# Altium schematic sheet 16 SATA3 CONTROLLER.SchDoc
size 420 x 297 mm
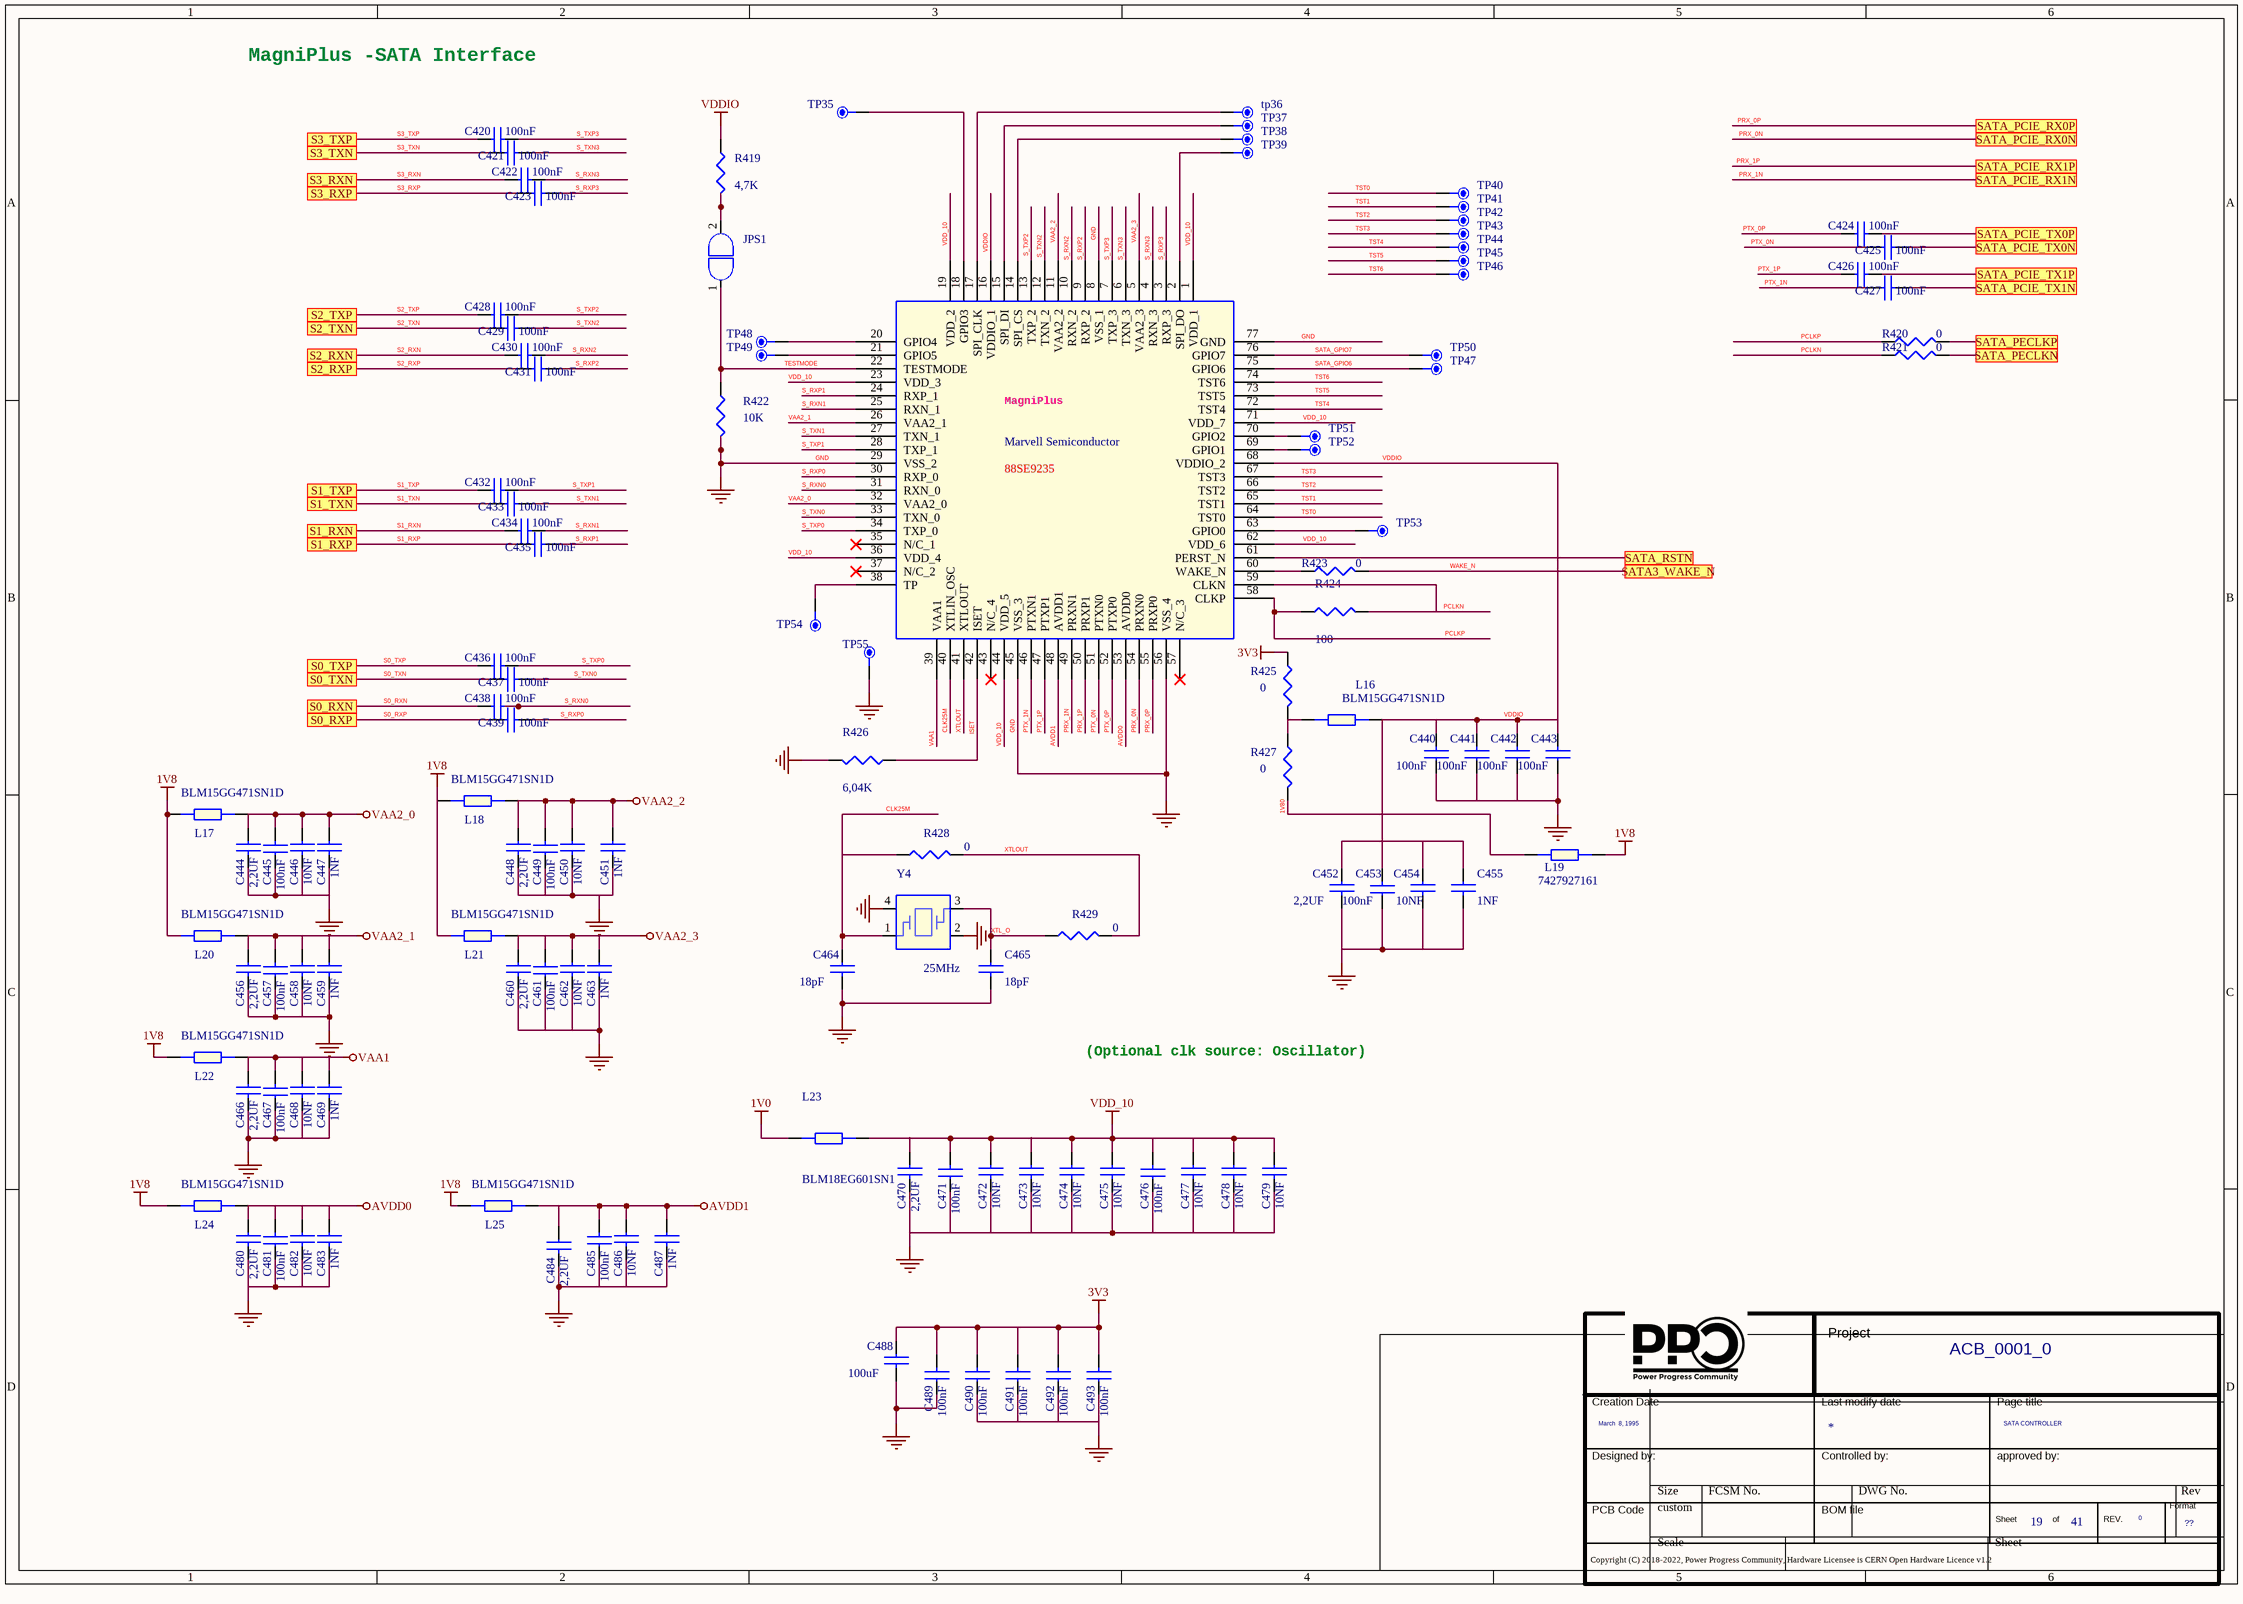
[diagram p0: 16 SATA3 CONTROLLER.SchDoc]

## Parts
*  Page Count: 41  Page Create Date: March  8, 1995  Page Number: 19  Page Size: ??  Page Title: SATA CONTROLLER  RevCode: 0  Title: ACB_0001_0  (hidden comment: Title_block_PPC)  (graphical)
C420  100nF  [SMD_0402]
C421  100nF  [SMD_0402]
C422  100nF  [SMD_0402]
C423  100nF  [SMD_0402]
C424  100nF  [SMD_0402]
C425  100nF  [SMD_0402]
C426  100nF  [SMD_0402]
C427  100nF  [SMD_0402]
C428  100nF  [SMD_0402]
C429  100nF  [SMD_0402]
C430  100nF  [SMD_0402]
C431  100nF  [SMD_0402]
C432  100nF  [SMD_0402]
C433  100nF  [SMD_0402]
C434  100nF  [SMD_0402]
C435  100nF  [SMD_0402]
C436  100nF  [SMD_0402]
C437  100nF  [SMD_0402]
C438  100nF  [SMD_0402]
C439  100nF  [SMD_0402]
C440  100nF  [SMD_0402]
C441  100nF  [SMD_0402]
C442  100nF  [SMD_0402]
C443  100nF  [SMD_0402]
C444  2,2UF  [SMD_0402]
C445  100nF  [SMD_0402]
C446  10NF  [SMD_0402]
C447  1NF  [SMD_0402]
C448  2,2UF  [SMD_0402]
C449  100nF  [SMD_0402]
C450  10NF  [SMD_0402]
C451  1NF  [SMD_0402]
C452  2,2UF  [SMD_0402]
C453  100nF  [SMD_0402]
C454  10NF  [SMD_0402]
C455  1NF  [SMD_0402]
C456  2,2UF  [SMD_0402]
C457  100nF  [SMD_0402]
C458  10NF  [SMD_0402]
C459  1NF  [SMD_0402]
C460  2,2UF  [SMD_0402]
C461  100nF  [SMD_0402]
C462  10NF  [SMD_0402]
C463  1NF  [SMD_0402]
C464  18pF  [SMD_0402]
C465  18pF  [SMD_0402]
C466  2,2UF  [SMD_0402]
C467  100nF  [SMD_0402]
C468  10NF  [SMD_0402]
C469  1NF  [SMD_0402]
C470  2,2UF  [SMD_0402]
C471  100nF  [SMD_0402]
C472  10NF  [SMD_0402]
C473  10NF  [SMD_0402]
C474  10NF  [SMD_0402]
C475  10NF  [SMD_0402]
C476  100nF  [SMD_0402]
C477  10NF  [SMD_0402]
C478  10NF  [SMD_0402]
C479  10NF  [SMD_0402]
C480  2,2UF  [SMD_0402]
C481  100nF  [SMD_0402]
C482  10NF  [SMD_0402]
C483  1NF  [SMD_0402]
C484  2,2UF  [SMD_0402]
C485  100nF  [SMD_0402]
C486  10NF  [SMD_0402]
C487  1NF  [SMD_0402]
C488  100uF  [SMD_0805]
C489  100nF  [SMD_0402]
C490  100nF  [SMD_0402]
C491  100nF  [SMD_0402]
C492  100nF  [SMD_0402]
C493  100nF  [SMD_0402]
JPS1  SOLDER JUMPER X 2  [PCB]  (value not drawn)
L16  BLM15GG471SN1D  [SMD_0402]
L17  BLM15GG471SN1D  [SMD_0402]
L18  BLM15GG471SN1D  [SMD_0402]
L19  7427927161  [SMD_0402]
L20  BLM15GG471SN1D  [SMD_0402]
L21  BLM15GG471SN1D  [SMD_0402]
L22  BLM15GG471SN1D  [SMD_0402]
L23  BLM18EG601SN1  [SMD_0603]
L24  BLM15GG471SN1D  [SMD_0402]
L25  BLM15GG471SN1D  [SMD_0402]
R419  4,7K  [SMD_0402]
R420  0  [SMD_0402]
R421  0  [SMD_0402]
R422  10K  [SMD_0402]
R423  0  [SMD_0402]
R424  100  [SMD_0402]
R425  0  [SMD_0402]
R426  6,04K  [SMD_0603]
R427  0  [SMD_0402]
R428  0  [SMD_0402]
R429  0  [SMD_0402]
TP35  TPS  [TPS]  (value not drawn)
tp36  TPS  [TPS]  (value not drawn)
TP37  TPS  [TPS]  (value not drawn)
TP38  TPS  [TPS]  (value not drawn)
TP39  TPS  [TPS]  (value not drawn)
TP40  TPS  [TPS]  (value not drawn)
TP41  TPS  [TPS]  (value not drawn)
TP42  TPS  [TPS]  (value not drawn)
TP43  TPS  [TPS]  (value not drawn)
TP44  TPS  [TPS]  (value not drawn)
TP45  TPS  [TPS]  (value not drawn)
TP46  TPS  [TPS]  (value not drawn)
TP47  TPS  [TPS]  (value not drawn)
TP48  TPS  [TPS]  (value not drawn)
TP49  TPS  [TPS]  (value not drawn)
TP50  TPS  [TPS]  (value not drawn)
TP51  TPS  [TPS]  (value not drawn)
TP52  TPS  [TPS]  (value not drawn)
TP53  TPS  [TPS]  (value not drawn)
TP54  TPS  [TPS]  (value not drawn)
TP55  TPS  [TPS]  (value not drawn)
U42  Distributor_Part_Number: Marvell Semiconductor  [76-pin QFN 
LBGA-196]  (hidden comment: 88SE9235)
Y4  25MHz  [SMD_5.0x3.2]

## Ports
S0_RXN, S0_RXP, S0_TXN, S0_TXP, S1_RXN, S1_RXP, S1_TXN, S1_TXP, S2_RXN, S2_RXP, S2_TXN, S2_TXP, S3_RXN, S3_RXP, S3_TXN, S3_TXP, SATA3_WAKE_N, SATA_PCIE_RX0N, SATA_PCIE_RX0P, SATA_PCIE_RX1N, SATA_PCIE_RX1P, SATA_PCIE_TX0N, SATA_PCIE_TX0P, SATA_PCIE_TX1N, SATA_PCIE_TX1P, SATA_PECLKN, SATA_PECLKP, SATA_RSTN

## Nets
1V0: L23.1
1V8: L17.1 L18.1 L19.2 L20.1 L21.1 L22.1 L24.1 L25.1
3V3: C488.1 C489.2 C490.2 C491.2 C492.2 C493.2 R425.2
AVDD0: C480.1 C481.2 C482.1 C483.1 L24.2 U42.53(AVDD0)
AVDD1: C484.1 C485.2 C486.1 C487.1 L25.2 U42.48(AVDD1)
GND: C440.1 C441.1 C442.1 C443.1 C444.2 C445.1 C446.2 C447.2 C448.2 C449.1 C450.2 C451.2 C452.2 C453.1 C454.2 C455.2 C456.2 C457.1 C458.2 C459.2 C460.2 C461.1 C462.2 C463.2 C464.2 C465.2 C466.2 C467.1 C468.2 C469.2 C470.2 C471.1 C472.2 C473.2 C474.2 C475.2 C476.1 C477.2 C478.2 C479.2 C480.2 C481.1 C482.2 C483.2 C484.2 C485.1 C486.2 C487.2 C488.2 C489.1 C490.1 C491.1 C492.1 C493.1 R422.2 R426.2 TP55.1 U42.8(VSS_1) U42.29(VSS_2) U42.45(VSS_3) U42.56(VSS_4) U42.77(GND) Y4.2 Y4.4
VAA1: C466.1 C467.2 C468.1 C469.1 L22.2 U42.39(VAA1)
VAA2_0: C444.1 C445.2 C446.1 C447.1 L17.2 U42.32(VAA2_0)
VAA2_1: C456.1 C457.2 C458.1 C459.1 L20.2 U42.26(VAA2_1)
VAA2_2: C448.1 C449.2 C450.1 C451.1 L18.2 U42.11(VAA2_2)
VAA2_3: C460.1 C461.2 C462.1 C463.1 L21.2 U42.5(VAA2_3)
VDD_10: C470.1 C471.2 C472.1 C473.1 C474.1 C475.1 C476.2 C477.1 C478.1 C479.1 L23.2 U42.1(VDD_1) U42.19(VDD_2) U42.23(VDD_3) U42.36(VDD_4) U42.44(VDD_5) U42.62(VDD_6) U42.71(VDD_7)
VDDIO: C440.2 C441.2 C442.2 C443.2 C452.1 C453.2 C454.1 C455.1 L16.1 R419.1 U42.16(VDDIO_1) U42.68(VDDIO_2)
1V80: L19.1 R427.1
CLK25M: C464.1 R428.2 U42.40(XTLIN_OSC) Y4.1
ISET: R426.1 U42.42(ISET)
PCLKN: R421.1 R424.2 U42.59(CLKN)
PCLKP: R420.1 R424.1 U42.58(CLKP)
PRX_0N: U42.54(PRXN0) ; port SATA_PCIE_RX0N
PRX_0P: U42.55(PRXP0) ; port SATA_PCIE_RX0P
PRX_1N: U42.49(PRXN1) ; port SATA_PCIE_RX1N
PRX_1P: U42.50(PRXP1) ; port SATA_PCIE_RX1P
PTX_0N: C425.1 U42.51(PTXN0)
PTX_0P: C424.1 U42.52(PTXP0)
PTX_1N: C427.1 U42.46(PTXN1)
PTX_1P: C426.1 U42.47(PTXP1)
S0_RXN: C438.1 ; port S0_RXN
S0_RXP: C439.1 ; port S0_RXP
S0_TXN: C437.1 ; port S0_TXN
S0_TXP: C436.1 ; port S0_TXP
S1_RXN: C434.1 ; port S1_RXN
S1_RXP: C435.1 ; port S1_RXP
S1_TXN: C433.1 ; port S1_TXN
S1_TXP: C432.1 ; port S1_TXP
S2_RXN: C430.1 ; port S2_RXN
S2_RXP: C431.1 ; port S2_RXP
S2_TXN: C429.1 ; port S2_TXN
S2_TXP: C428.1 ; port S2_TXP
S3_RXN: C422.1 ; port S3_RXN
S3_RXP: C423.1 ; port S3_RXP
S3_TXN: C421.1 ; port S3_TXN
S3_TXP: C420.1 ; port S3_TXP
S_RXN0: C438.2 U42.31(RXN_0)
S_RXN1: C434.2 U42.25(RXN_1)
S_RXN2: C430.2 U42.10(RXN_2)
S_RXN3: C422.2 U42.4(RXN_3)
S_RXP0: C439.2 U42.30(RXP_0)
S_RXP1: C435.2 U42.24(RXP_1)
S_RXP2: C431.2 U42.9(RXP_2)
S_RXP3: C423.2 U42.3(RXP_3)
S_TXN0: C437.2 U42.33(TXN_0)
S_TXN1: C433.2 U42.27(TXN_1)
S_TXN2: C429.2 U42.12(TXN_2)
S_TXN3: C421.2 U42.6(TXN_3)
S_TXP0: C436.2 U42.34(TXP_0)
S_TXP1: C432.2 U42.28(TXP_1)
S_TXP2: C428.2 U42.13(TXP_2)
S_TXP3: C420.2 U42.7(TXP_3)
SATA_GPIO6: TP47.1 U42.75(GPIO6)
SATA_GPIO7: TP50.1 U42.76(GPIO7)
SATA_PCIE_TX0N: C425.2 ; port SATA_PCIE_TX0N
SATA_PCIE_TX0P: C424.2 ; port SATA_PCIE_TX0P
SATA_PCIE_TX1N: C427.2 ; port SATA_PCIE_TX1N
SATA_PCIE_TX1P: C426.2 ; port SATA_PCIE_TX1P
SATA_PECLKN: R421.2 ; port SATA_PECLKN
SATA_PECLKP: R420.2 ; port SATA_PECLKP
SATA_RSTN: U42.61(PERST_N) ; port SATA_RSTN
TESTMODE: JPS1.1 R422.1 U42.22(TESTMODE)
TST0: TP40.1 U42.64(TST0)
TST1: TP41.1 U42.65(TST1)
TST2: TP42.1 U42.66(TST2)
TST3: TP43.1 U42.67(TST3)
TST4: TP44.1 U42.72(TST4)
TST5: TP45.1 U42.73(TST5)
TST6: TP46.1 U42.74(TST6)
WAKE_N: R423.2 ; port SATA3_WAKE_N
XTL_O: C465.1 R429.2 Y4.3
XTLOUT: R428.1 R429.1 U42.41(XTLOUT)
NetJPS1_2: JPS1.2 R419.2
NetL16_2: L16.2 R425.1 R427.2
NetR423_1: R423.1 U42.60(WAKE_N)
NetTP35_1: TP35.1 U42.18(GPIO3)
Nettp36_1: tp36.1 U42.17(SPI_CLK)
NetTP37_1: TP37.1 U42.15(SPI_DI)
NetTP38_1: TP38.1 U42.14(SPI_CS)
NetTP39_1: TP39.1 U42.2(SPI_DO)
NetTP48_1: TP48.1 U42.20(GPIO4)
NetTP49_1: TP49.1 U42.21(GPIO5)
NetTP51_1: TP51.1 U42.70(GPIO2)
NetTP52_1: TP52.1 U42.69(GPIO1)
NetTP53_1: TP53.1 U42.63(GPIO0)
NetTP54_1: TP54.1 U42.38(TP)

Not connected (* = marked no-connect by the designer): U42 35(N/C_1)* 37(N/C_2)* 43(N/C_4)* 57(N/C_3)*

## Notes on the sheet
- MagniPlus -SATA Interface
- (near U42) MagniPlus
- (Optional clk source: Oscillator)
- (in symbol Title_block_PPC) Project; Creation Date; Last modify date; Page title; Designed by:; Controlled by:; approved by:; Format; PCB Code; BOM file; Sheet; of; REV.; Copyright (C) 2018-2022, Power Progress Community, Hardware Licensee is CERN Open Hardware Licence v1.2

## Library data of the parts
C420 C422 C425 C426 C428 C430 C432 C434 C437 C439 C449 C453 C485 = CAP NP_Dup10: COND.CER. 100NF 50V 0402 X7R SMD; Manufacturer Part Number 1: CGA2B3X7R1H104M050BD; Manufacturer 1: TDK; Part Number: PASSIVE_24; RSM: RC0402; PCB Footprint: SMD_0402; Distributor 1: MURATA ELETTRONICA SPA; Part Type: Capacitors\Ceramic\SMD\0402
C421 C423 C424 C427 C429 C431 C433 C435 C436 C438 C440-C443 C445 C457 C461 C467 C471 C476 C481 C489-C493 = CAP NP_Dup10: COND.CER. 100NF 50V 0402 X7R SMD; Part Number: PASSIVE_24; Manufacturer 1: TDK; Manufacturer Part Number 1: CGA2B3X7R1H104M050BD; RSM: RC0402; PCB Footprint: SMD_0402; Part Type: Capacitors\Ceramic\SMD\0402; Distributor 1: MURATA ELETTRONICA SPA
C444 C452 C456 C460 C466 C480 = CAP NP_Dup10: CAP CERAMIC 2.2UF 6.3V X5R 0402; Manufacturer Part Number 1: ECJ-0EB0J225M; Manufacturer 1: Panasonic - ECG; Part Number: PASSIVE_55; RSM: RC0402; PCB Footprint: SMD_0402; Distributor 1: DIGIKEY (PCC2421TR-ND); Part Type: Capacitors\Ceramic\SMD\0402
C446 C458 C462 C468 C472-C475 C477-C479 C482 = CAP NP_Dup10: COND.CER. 10NF 50V 0402 X7R SMD; Manufacturer Part Number 1: C0402C103K5RACTU; Manufacturer 1: KEMET; Part Number: PASSIVE_29; RSM: RC0402; PCB Footprint: SMD_0402; Distributor 1: TTI ITALY SRL; Part Type: Capacitors\Ceramic\SMD\0402
C447 C451 C459 C463 C469 C483 C487 = CAP NP_Dup10: COND.CER. 1NF 50V 0402 NPO SMD; Manufacturer Part Number 1: 223858715523; Manufacturer 1: YAGEO; Part Number: PASSIVE_46; RSM: RC0402; PCB Footprint: SMD_0402; Distributor 1: CLAITRON LASI SILVESTAR S.R.L.; Part Type: Capacitors\Ceramic\SMD\0402
C448 C470 C484 = CAP NP_Dup10: CAP CERAMIC 2.2UF 6.3V X5R 0402; Part Number: PASSIVE_55; Manufacturer 1: Panasonic - ECG; Manufacturer Part Number 1: ECJ-0EB0J225M; RSM: RC0402; PCB Footprint: SMD_0402; Part Type: Capacitors\Ceramic\SMD\0402; Distributor 1: DIGIKEY (PCC2421TR-ND)
C450 C454 C486 = CAP NP_Dup10: COND.CER. 10NF 50V 0402 X7R SMD; Part Number: PASSIVE_29; Manufacturer 1: KEMET; Manufacturer Part Number 1: C0402C103K5RACTU; RSM: RC0402; PCB Footprint: SMD_0402; Part Type: Capacitors\Ceramic\SMD\0402; Distributor 1: TTI ITALY SRL
C455 = CAP NP_Dup10: COND.CER. 1NF 50V 0402 NPO SMD; Part Number: PASSIVE_46; Manufacturer 1: YAGEO; Manufacturer Part Number 1: 223858715523; RSM: RC0402; PCB Footprint: SMD_0402; Part Type: Capacitors\Ceramic\SMD\0402; Distributor 1: CLAITRON LASI SILVESTAR S.R.L.
C464 = CAP NP_Dup10: CAP CER 18PF 50V 5% NP0 0402; Part Number: PASSIVE_43; Manufacturer 1: TDK; Manufacturer Part Number 1: C1005C0G1H180J; RSM: RC0402; PCB Footprint: SMD_0402; Part Type: Capacitors\Ceramic\SMD\0402; Distributor 1: DIGIKEY (445-1238-1-ND)
C465 = CAP NP_Dup10: CAP CER 18PF 50V 5% NP0 0402; Manufacturer Part Number 1: C1005C0G1H180J; Manufacturer 1: TDK; Part Number: PASSIVE_43; RSM: RC0402; PCB Footprint: SMD_0402; Distributor 1: DIGIKEY (445-1238-1-ND); Part Type: Capacitors\Ceramic\SMD\0402
C488 = CAP NP_Dup10: CAP CER 100UF 6.3V 20% X5R 0805; Manufacturer Part Number 1: GRM21BR60J107ME15L; Manufacturer 1: Murata; Part Number: PASSIVE_202; RSM: RC0805; PCB Footprint: SMD_0805; Distributor 1: FARNELL(2494476); Part Type: Capacitors\Ceramic\SMD\0805
JPS1 = SOLDER JUMPER 2x1: SODER JUMPER SU PCB; Part Number: CONNECTORS_335; RSM: JMPS2; PCB Footprint: PCB; Part Type: SOLDER JUMPER
L16 L18 L25 = FERRITE_BEAD_Dup1: FERRITE CHIP 470 OHM 200MA 0402; Manufacturer 1: Murata; Part Number: PASSIVE_371; RSM: RC0402; PCB Footprint: SMD_0402; Distributor 1: DIGIKEY (	490-5198-1-ND); Manufacturer Part Number 1: BLM15GG471SN1D; Part Type: Ferrite Beads\SMD\0402
L17 L20-L22 L24 = FERRITE_BEAD_Dup1: FERRITE CHIP 470 OHM 200MA 0402; Part Number: PASSIVE_371; Manufacturer 1: Murata; RSM: RC0402; PCB Footprint: SMD_0402; Part Type: Ferrite Beads\SMD\0402; Manufacturer Part Number 1: BLM15GG471SN1D; Distributor 1: DIGIKEY (	490-5198-1-ND)
L19 = FERRITE_BEAD: FERRITE BEAD 600R 0.25A 0402; Part Number: PASSIVE_369; Manufacturer 1: WURTH; RSM: RC0402; PCB Footprint: SMD_0402; Part Type: Ferrite Beads\SMD\0402; Manufacturer Part Number 1: 7427927161
L23 = FERRITE_BEAD: FERRITE BEAD 600ohm 500mA 0603 SMD; Part Number: PASSIVE_377; Manufacturer 1: Murata; Manufacturer Part Number 1: BLM18EG601SN1 SMD; RSM: RC0603; Part Type: Ferrite Beads\SMD\0603; PCB Footprint: SMD_0603
R419 = R_Dup9: RESIS.CHIP 4,7K 5% 0402 SMD; Part Number: PASSIVE_861; Manufacturer 1: ROYAL OHM; RSM: RC0402; PCB Footprint: SMD_0402; Part Type: Resistors\Fixed\SMD\0402\5%; Manufacturer Part Number 1: RESIS.CHIP 4,7K 5% 0402 SMD; Distributor 1: CAMEL ELETTRONICA SRL  #
R420 R421 R423 R425 R427-R429 = R_Dup9: RESIS.CHIP 0R 5% 0402 SMD; Manufacturer 1: ROYAL OHM; Part Number: PASSIVE_805; RSM: RC0402; PCB Footprint: SMD_0402; Distributor 1: CAMEL ELETTRONICA SRL  #; Manufacturer Part Number 1: RESIS.CHIP 0R 5% 0402 SMD; Part Type: Resistors\Fixed\SMD\0402\5%
R422 = R_Dup6: RESIS.CHIP 10K 1% 0402 SMD; Part Number: PASSIVE_584; Manufacturer 1: ROYAL OHM; RSM: RC0402; Part Type: Resistors\Fixed\SMD\0402\1%; PCB Footprint: SMD_0402; Manufacturer Part Number 1: RESIS.CHIP 10K 1% 0402 SMD
R424 = R_Dup6: RESIS.CHIP 100R 5% 0402 SMD; Part Number: PASSIVE_812; Manufacturer 1: ROYAL OHM; RSM: RC0402; Part Type: Resistors\Fixed\SMD\0402\5%; PCB Footprint: SMD_0402; Manufacturer Part Number 1: RESIS.CHIP 100R 5% 0402 SMD
R426 = R_Dup6: RESIS.CHIP 6K04 1% 0603 SMD; Part Number: PASSIVE_1047; Manufacturer 1: ROYAL OHM; RSM: RC0603; Part Type: Resistors\Fixed\SMD\0603\1%; PCB Footprint: SMD_0603; Manufacturer Part Number 1: RESIS.CHIP 6K04 1% 0603 SMD
TP35 tp36 TP37-TP55 = TPS_2: Test Point, .025 sq pin; MFR_Name: Samtec; Mfr_Part_Number: Cut From Strip; PCB Footprint: tp36; RSM: AE-TESTPOINT; Distributor_Part_Number: no parts needed
U42 = 2020_34: Two-Lane PCIe 2.0 to Four-Port 6; Mfr_Part_Number: 88SE9230; MFR_Name: Marvell Semi; Part Number: LOGIC_356; Manufacturer 1: MARVELL; RSM: QFN-76-EP_9X9; PCB Footprint: 76-pin QFN / LBGA-196; Display Value: 88SE9235; Distributor: tbd; Part Type: PCIE\SATA; Manufacturer Part Number 1: 88SE9235; Distributor 1: MARVELL(88SE9235A1-NAA2C000)
Y4 = CRYSTAL_4P_Dup2: CRYSTAL 25.000 MHZ 20PF SMD; Part Number: MISC_166; Manufacturer 1: ECS; Manufacturer Part Number 1: ECS-250-20-30B-TR (ROHS COMPLIANT); RSM: XC-CSX2; PCB Footprint: SMD_5.0x3.2; Part Type: Quartz; Distributor 1: DIGIKEY (XC1124CT-ND)
* = Title_block_PPC: Page Modify Date: *